# EAGLE design M_L_ext_switch (EAGLE 9.6.2)
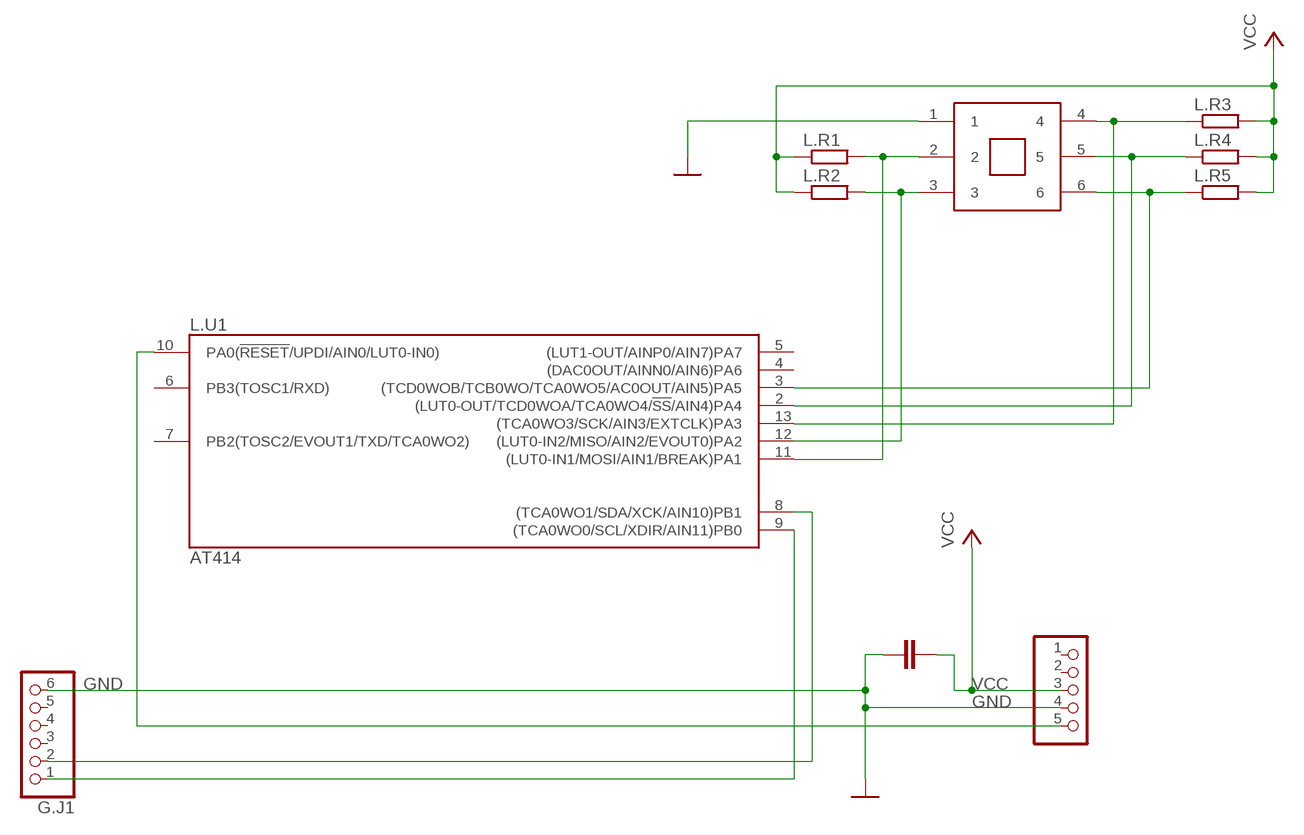
[diagram p0: schematic, sheet 1]

## Parts
G.J1  PINHD-1X6  [1X06]
G.J2  PINHD-1X5  [1X05]
L.C1  100n  C-EUC0603  [C0603]
L.R1  R-EU_R0603  [R0603]
L.R2  R-EU_R0603  [R0603]
L.R3  R-EU_R0603  [R0603]
L.R4  R-EU_R0603  [R0603]
L.R5  R-EU_R0603  [R0603]
L.SW1  5_WAY_SWITCH  [5_WAY_SWITCH]
L.U1  AT414  ATTINY214-SSF  [SO14]

## Nets
GND: G.J1.6 G.J2.4 L.C1.1 L.SW1.1
N$1: G.J1.1 L.U1.9((TCA0WO0/SCL/XDIR/AIN11)PB0)
N$2: G.J1.2 L.U1.8((TCA0WO1/SDA/XCK/AIN10)PB1)
N$3: G.J2.5 L.U1.10(PA0(!RESET!/UPDI/AIN0/LUT0-IN0))
N$5: L.R5.1 L.SW1.6 L.U1.3((TCD0WOB/TCB0WO/TCA0WO5/AC0OUT/AIN5)PA5)
N$6: L.R4.1 L.SW1.5 L.U1.2((LUT0-OUT/TCD0WOA/TCA0WO4/!SS!/AIN4)PA4)
N$7: L.R3.1 L.SW1.4 L.U1.13((TCA0WO3/SCK/AIN3/EXTCLK)PA3)
N$8: L.R2.2 L.SW1.3 L.U1.12((LUT0-IN2/MISO/AIN2/EVOUT0)PA2)
N$9: L.R1.2 L.SW1.2 L.U1.11((LUT0-IN1/MOSI/AIN1/BREAK)PA1)
VCC: G.J2.3 L.C1.2 L.R1.1 L.R2.1 L.R3.2 L.R4.2 L.R5.2
Unconnected: G.J1.3 G.J1.4 G.J1.5 G.J2.1 G.J2.2 L.U1.4((DAC0OUT/AINN0/AIN6)PA6) L.U1.5((LUT1-OUT/AINP0/AIN7)PA7) L.U1.6(PB3(TOSC1/RXD)) L.U1.7(PB2(TOSC2/EVOUT1/TXD/TCA0WO2))

## Power pins joined to a net without a drawn wire
GND: L.U1.14(GND)
VCC: L.U1.1(VCC)

## Library data of the parts
G.J1 = pinhead2:PINHD-1X6: PIN HEADER
G.J2 = pinhead2:PINHD-1X5: PIN HEADER
L.C1 = rcl:C-EU: CAPACITOR, European symbol; SPICEPREFIX: C
L.R1-L.R5 = rcl:R-EU_: RESISTOR, European symbol; SPICEPREFIX: R
L.SW1 = hugo:5_WAY_SWITCH
L.U1 = atmel:ATTINY*14: 8-bit AVR tiny-1-series Microcontroller CPU: two-cycle hardware multiplier single pin Unified Program Debug Interface (UPDI) programmable watchdog timer with separate on-chip oscillator programmable brown-out detection circuit with software disable function internal calibrated oscillator Status aktiv aktiv aktiv aktiv ATtiny214 ATtiny414 ATtiny814 ATtiny1614 General purpose working registers 32 SRAM 128 B 256 B 512 B 2 kB Program flash memory 2 kB 4 kB 8 kB 16 kB EEPROM 64 B 128 B 128 B 256 B 16-bit Timer/Counter type A (TCA) 1 16-bit Timer/Counter type B (TCB) 1 2 12-bit Timer/Counter type D (TCD) 1 Real Time Counter (RTC) 1 USART 1 SPI 1 TWI (I2C) 1 ADC 1 2 ADC channels 10 10+4 ADC resolution 10 bit DAC 1 3 AC 1 3 Peripheral Touch Controller (PTC) - 1 PTC number of self-capacitance channels - 6 PTC number of mutual-capacitance channels - 9 Custom Configurable Logic/Lookup tables 1/2 Window Watchdog 1 Event System channels 6 General purpose I/O 12 External interrupts 12 CRCSCAN 1 Operating voltage 1.8 ... 5.5 V Speed grade 0 ... 5 MHz @ 1.8 ... 5.5 V 0 ... 10 MHz @ 2.7 ... 5.5 V 0 ... 20 MHz @ 4.5 ... 5.5 V Clock options internal 16/20 MHz low power RC oscillator internal 32.768 kHz ultra low power RC oscillator external 32.768 kHz low-frequency crystal oscillator external clock input Pin Name Other/Special ADC0 ADC1 PTC AC0 AC1 AC2 DAC0 USART0 SPI0 TWI0 TCA0 TCBn TCD0 CCL PA0 !RESET, UPDI AIN0 LUT0-IN0 PA1 AIN1 TxD MOSI SDA LUT0-IN1 PA2 EVOUT0 AIN2 RxD MISO SCL LUT0-IN2 PA3 EXTCLK AIN3 XCK SCK WO3 TCB1 WO PA4 AIN4 AIN0 X0/Y0 XDIR !SS WO4 WOA LUT0-OUT PA5 VREFA AIN5 AIN1 X1/Y1 OUT AINN0 WO5 TCB0 WO WOB PA6 AIN6 AIN2 X2/Y2 AINN0 AINP1 AINP0 OUT PA7 AIN7 AIN3 X3/Y3 AINP0 AINP0 AINN0 LUT1-OUT PB3 TOSC1 OUT RxD WO0 PB2 TOSC2, EVOUT1 OUT TxD WO2 PB1 AIN10 X4/Y4 AINP2 XCK SDA WO1 PB0 AIN11 X5/Y5 AINP2 AINP1 XDIR SCL WO0 only available in devices with 8/16KByte flash, X- or Y-line only available in device ATtiny1614

## Board
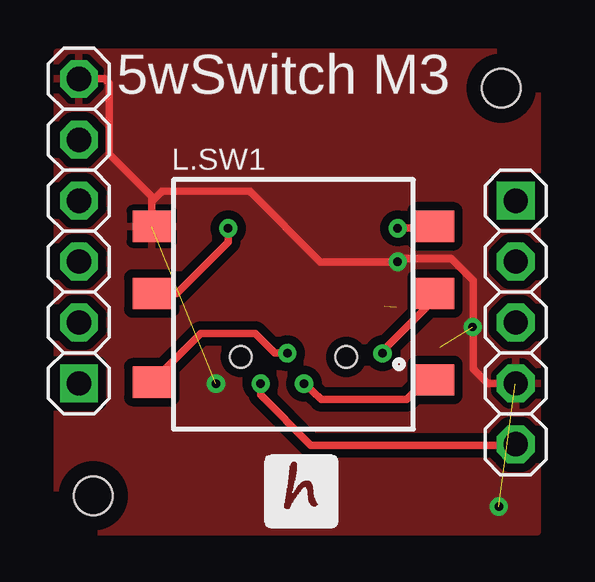
[diagram p1: board, top side]
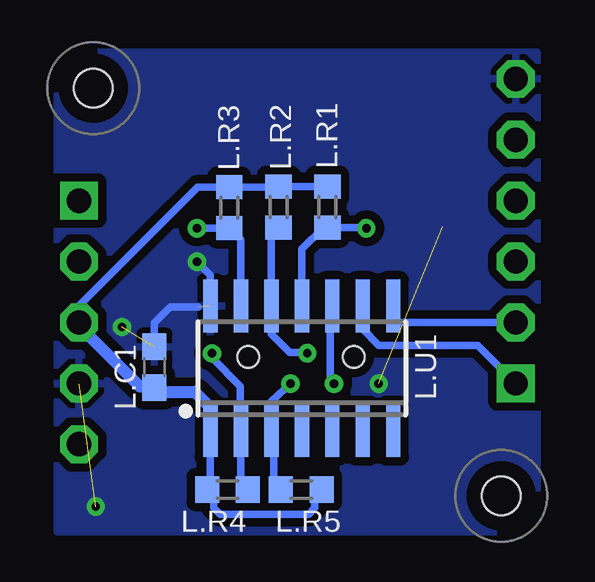
[diagram p2: board, bottom side, seen from below]

No outline drawn. Coordinates in mm, seen from the top.
Copper layers (1*16): Top 0.035mm / dielectric 1.5mm / Bottom 0.035mm
Design rules "default *": minimum track width 12mil, minimum drill 0.35mm, track to track 14mil, track to pad 13mil, pad to pad 10mil, via to via 14mil, smd to smd 14mil, copper to edge 15mil, drill to drill 15mil, minimum pad ring 10mil, minimum via ring 8mil, stop-mask expansion 4mil, vias tented up to drill 0mil, thermal gap 10mil
Holes 1.6 mm at 2,2 19,19
tRestrict: area 18,18 to 20,20; area 1,1 to 3,3
bRestrict: area 1,1 to 3,3; area 18,18 to 20,20

### Footprints (pad centres in the part's own frame; a part is rotated, then mirrored left to right if it is on the bottom)
1X06 = drill 1.016 pad 1.575 square: 1 -6.35,0 | drill 1.016 pad 1.575 octagon: 2 -3.81,0; 3 -1.27,0; 4 1.27,0; 5 3.81,0; 6 6.35,0
1X05 = drill 1.016 pad 1.575 square: 1 -5.08,0 | drill 1.016 pad 1.575 octagon: 2 -2.54,0; 3 0,0; 4 2.54,0; 5 5.08,0
C0603 = smd 1.1 x 1: 1 -0.85,0; 2 0.85,0
R0603 = smd 1 x 1.1: 1 -0.85,0; 2 0.85,0
5_WAY_SWITCH = smd 1.6 x 1.3: 1 -6,3; 2 -6,0.2; 3 -6,-3.5; 4 5.8,3; 5 5.8,0.2; 6 5.8,-3.4 | hole 0.9: 2.1,-2.45; -2.3,-2.45
SO14 = smd 0.6 x 2.2: 1 -3.81,-2.6; 2 -2.54,-2.6; 3 -1.27,-2.6; 4 0,-2.6; 5 1.27,-2.6; 6 2.54,-2.6; 7 3.81,-2.6; 8 3.81,2.6; 9 2.54,2.6; 10 1.27,2.6; 11 0,2.6; 12 -1.27,2.6; 13 -2.54,2.6; 14 -3.81,2.6

### Placement (x,y rotation side)
G.J1  1.4,13.04 90 top
G.J2  19.6,9.23 270 top
L.C1  16.46,7.37 270 bottom
L.R1  9.25,14.05 270 bottom
L.R2  11.28,14.05 270 bottom
L.R3  13.34,14.02 90 bottom
L.R4  13.41,2.26 180 bottom
L.R5  10.34,2.26 0 bottom
L.SW1  10.44,10.24 0 top
L.U1  10.31,7.32 0 bottom

### Tracks (layer width: path | path; a pad name or v marks a point on that pad's centre or on a via)
GND  (via drill 0.35)  (4 unrouted)
  Top 0.305: G.J2.4 18.43,6.69 17.83,7.29 17.83,10.98 16.91,11.9 14.82,11.9 v14.68,11.76 11.46,11.76 8.52,14.71 4.87,14.71 4.44,14.28 L.SW1.1 4.44,14.48 2.67,16.25 2.67,19.2 2.48,19.39 G.J1.6
  Bottom 0.305: 19.58,6.67 G.J2.4 | L.U1.14 14.12,11.2 v14.68,11.76 | L.C1.1 16.46,9.21 15.79,9.88 14.63,9.88
  other vias: 17.81,9.04 7.11,6.68 18.9,1.55
  pour Top (isolate 0.305): 0.5,20.5 0.5,0.5 20.5,0.5 20.5,20.5
  pour Bottom (isolate 0.305): 0.5,20.5 0.5,0.5 20.5,0.5 20.5,20.5
N$1
  Bottom 0.305: G.J1.1 2.99,8.28 7.1,8.28 7.77,8.95 L.U1.9
N$2
  Bottom 0.305: G.J1.2 6.5,9.23 L.U1.8
N$3  (via drill 0.35)
  Top 0.305: v8.97,6.68 8.97,6.21 11.07,4.11 19.56,4.11 G.J2.5
  Bottom 0.305: L.U1.10 9.12,9.84 9.12,6.83 v8.97,6.68
N$5  (via drill 0.35)
  Top 0.305: L.SW1.6 15.87,6.84 15.05,6.02 11.51,6.02 v10.78,6.68
  Bottom 0.305: v10.78,6.68 11.58,5.94 L.U1.3 11.48,4.61 11.48,2.55 L.R5.1
N$6  (via drill 0.35)
  Top 0.305: L.SW1.5 16.24,10.23 14.05,8.05 v14.05,7.94
  Bottom 0.305: v14.05,7.94 14.05,7.74 12.88,6.57 12.88,4.75 L.U1.2 12.85,2.55 L.R4.1
N$7  (via drill 0.35)
  Top 0.305: L.SW1.4 16.16,13.16 v14.68,13.16
  Bottom 0.305: L.U1.13 12.86,12.7 L.R3.1 14.64,13.17 v14.68,13.16
N$8  (via drill 0.35)
  Top 0.305: v10.08,7.95 9.57,7.95 8.75,8.77 6.47,8.77 L.SW1.3
  Bottom 0.305: L.R2.2 11.28,13.17 11.58,12.87 L.U1.12 11.58,8.75 10.81,7.98 10.11,7.98 v10.08,7.95
N$9  (via drill 0.35)
  Top 0.305: L.SW1.2 5.48,10.44 7.62,12.57 v7.62,13.16
  Bottom 0.305: v7.62,13.16 7.87,13.16 7.91,13.2 L.R1.2 9.4,13.2 10.31,12.28 L.U1.11
VCC
  Bottom 0.305: L.R5.2 9.77,1.98 9.77,1.49 10.03,1.23 13.72,1.23 13.98,1.49 13.98,1.98 L.R4.2 14.16,2.26 14.12,2.3 L.U1.1 | L.R1.1 L.R2.1 11.3,14.87 L.R3.2 14.65,14.87 19.6,9.92 G.J2.3 | L.C1.2 16.49,6.55 17.05,6.55
  Bottom 0.508: L.U1.1 14.12,5.68 14.78,6.34 16.28,6.34 L.C1.2 | 17.05,6.55 19.6,9.1 G.J2.3

### Text on the board
tPlace: 5wSwitch M3